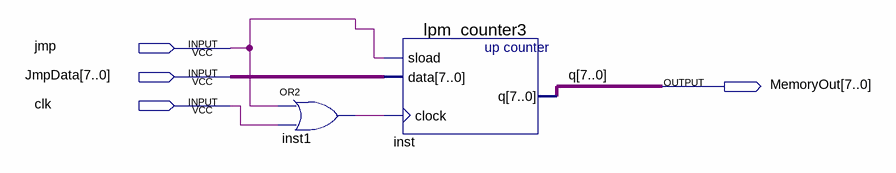
[diagram p0: schematic sheet]
// Quartus schematic IPreg.bdf as structural Verilog: 2 symbols, 4 pins
module IPreg (
  input  jmp,
  input  [7:0] JmpData,
  input  clk,
  output [7:0] MemoryOut
);

  wire inst1_out;

  or inst1 (inst1_out, jmp, clk);
  lpm_counter3 inst (.sload(jmp), .data(JmpData), .clock(inst1_out), .q(MemoryOut));

  // Other names for the same wires on the sheet: q[7:0] = MemoryOut
endmodule
